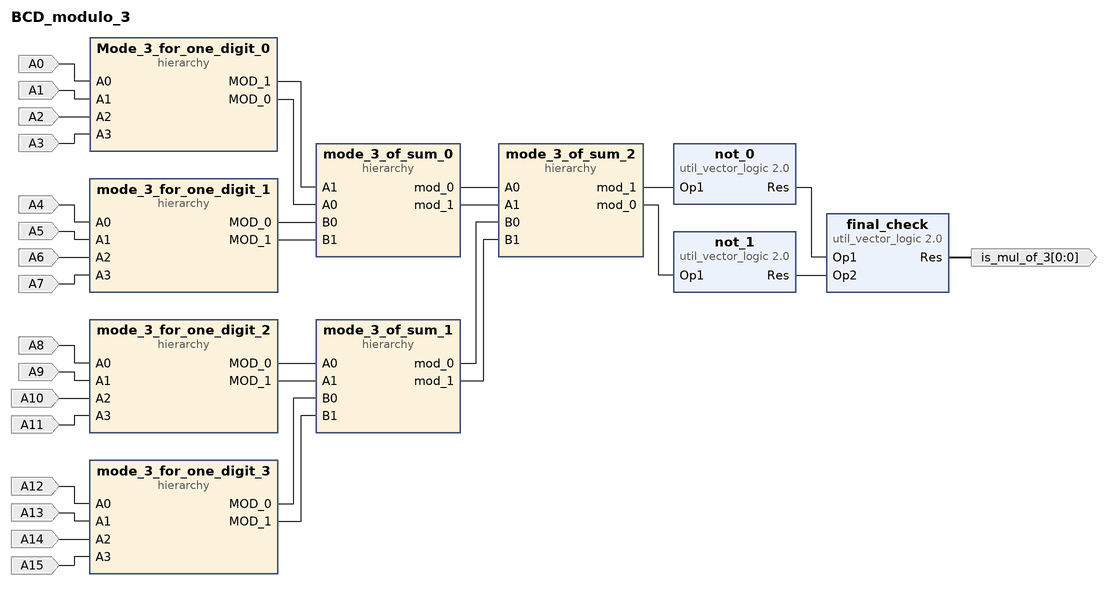
[diagram p0: block diagram of the top level]
# Vivado block design BCD_modulo_3, xc7a35tcpg236-1, Vivado 2019.1
create_bd_design BCD_modulo_3

create_bd_port -dir I A0
create_bd_port -dir I A1
create_bd_port -dir I A2
create_bd_port -dir I A3
create_bd_port -dir I A4
create_bd_port -dir I A5
create_bd_port -dir I A6
create_bd_port -dir I A7
create_bd_port -dir I A8
create_bd_port -dir I A9
create_bd_port -dir I A10
create_bd_port -dir I A11
create_bd_port -dir I A12
create_bd_port -dir I A13
create_bd_port -dir I A14
create_bd_port -dir I A15
create_bd_port -dir O -from 0 -to 0 is_mul_of_3

create_bd_cell -type hier Mode_3_for_one_digit_0
create_bd_cell -type hier mode_3_for_one_digit_1
create_bd_cell -type hier mode_3_of_sum_0
create_bd_cell -type hier mode_3_for_one_digit_2
create_bd_cell -type hier mode_3_for_one_digit_3
create_bd_cell -type hier mode_3_of_sum_1
create_bd_cell -type hier mode_3_of_sum_2
create_bd_cell -type ip -vlnv xilinx.com:ip:util_vector_logic:2.0 not_0
set_property -dict {CONFIG.C_OPERATION not CONFIG.C_SIZE 1} [get_bd_cells not_0]
create_bd_cell -type ip -vlnv xilinx.com:ip:util_vector_logic:2.0 not_1
set_property -dict {CONFIG.C_OPERATION not CONFIG.C_SIZE 1} [get_bd_cells not_1]
create_bd_cell -type ip -vlnv xilinx.com:ip:util_vector_logic:2.0 final_check
set_property -dict {CONFIG.C_OPERATION and CONFIG.C_SIZE 1} [get_bd_cells final_check]

# ---- hierarchy /Mode_3_for_one_digit_0 ----
current_bd_instance /Mode_3_for_one_digit_0
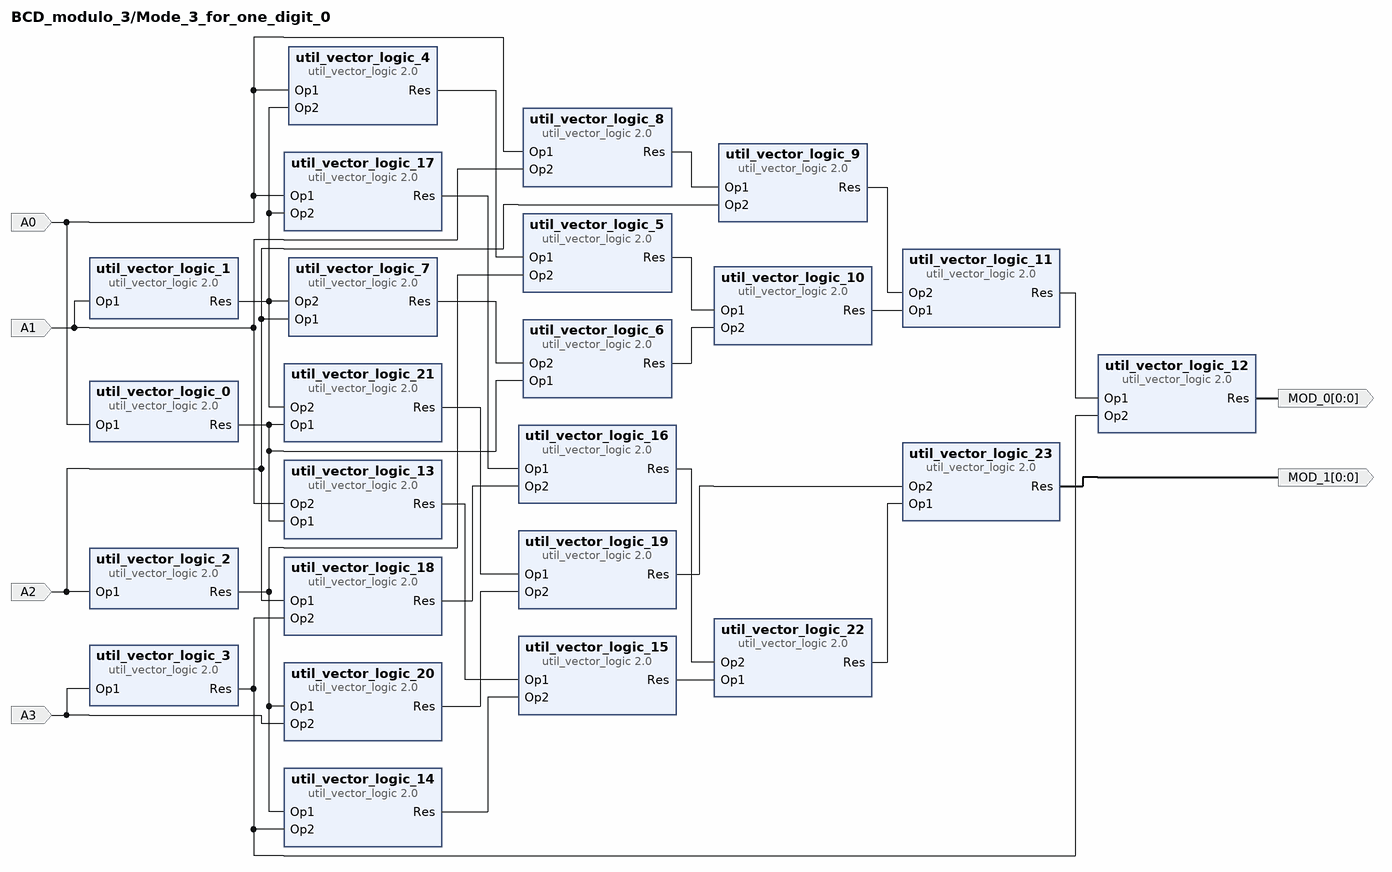
[diagram p1: block diagram inside /Mode_3_for_one_digit_0]
create_bd_pin -dir I A0
create_bd_pin -dir I A1
create_bd_pin -dir I A2
create_bd_pin -dir I A3
create_bd_pin -dir O -from 0 -to 0 MOD_0
create_bd_pin -dir O -from 0 -to 0 MOD_1

create_bd_cell -type ip -vlnv xilinx.com:ip:util_vector_logic:2.0 util_vector_logic_0
set_property -dict {CONFIG.C_OPERATION not CONFIG.C_SIZE 1} [get_bd_cells util_vector_logic_0]
create_bd_cell -type ip -vlnv xilinx.com:ip:util_vector_logic:2.0 util_vector_logic_1
set_property -dict {CONFIG.C_OPERATION not CONFIG.C_SIZE 1} [get_bd_cells util_vector_logic_1]
create_bd_cell -type ip -vlnv xilinx.com:ip:util_vector_logic:2.0 util_vector_logic_2
set_property -dict {CONFIG.C_OPERATION not CONFIG.C_SIZE 1} [get_bd_cells util_vector_logic_2]
create_bd_cell -type ip -vlnv xilinx.com:ip:util_vector_logic:2.0 util_vector_logic_3
set_property -dict {CONFIG.C_OPERATION not CONFIG.C_SIZE 1} [get_bd_cells util_vector_logic_3]
create_bd_cell -type ip -vlnv xilinx.com:ip:util_vector_logic:2.0 util_vector_logic_4
set_property -dict {CONFIG.C_SIZE 1} [get_bd_cells util_vector_logic_4]
create_bd_cell -type ip -vlnv xilinx.com:ip:util_vector_logic:2.0 util_vector_logic_5
set_property -dict {CONFIG.C_SIZE 1} [get_bd_cells util_vector_logic_5]
create_bd_cell -type ip -vlnv xilinx.com:ip:util_vector_logic:2.0 util_vector_logic_6
set_property -dict {CONFIG.C_SIZE 1} [get_bd_cells util_vector_logic_6]
create_bd_cell -type ip -vlnv xilinx.com:ip:util_vector_logic:2.0 util_vector_logic_7
set_property -dict {CONFIG.C_SIZE 1} [get_bd_cells util_vector_logic_7]
create_bd_cell -type ip -vlnv xilinx.com:ip:util_vector_logic:2.0 util_vector_logic_8
set_property -dict {CONFIG.C_SIZE 1} [get_bd_cells util_vector_logic_8]
create_bd_cell -type ip -vlnv xilinx.com:ip:util_vector_logic:2.0 util_vector_logic_9
set_property -dict {CONFIG.C_SIZE 1} [get_bd_cells util_vector_logic_9]
create_bd_cell -type ip -vlnv xilinx.com:ip:util_vector_logic:2.0 util_vector_logic_10
set_property -dict {CONFIG.C_OPERATION or CONFIG.C_SIZE 1} [get_bd_cells util_vector_logic_10]
create_bd_cell -type ip -vlnv xilinx.com:ip:util_vector_logic:2.0 util_vector_logic_11
set_property -dict {CONFIG.C_OPERATION or CONFIG.C_SIZE 1} [get_bd_cells util_vector_logic_11]
create_bd_cell -type ip -vlnv xilinx.com:ip:util_vector_logic:2.0 util_vector_logic_12
set_property -dict {CONFIG.C_SIZE 1} [get_bd_cells util_vector_logic_12]
create_bd_cell -type ip -vlnv xilinx.com:ip:util_vector_logic:2.0 util_vector_logic_13
set_property -dict {CONFIG.C_SIZE 1} [get_bd_cells util_vector_logic_13]
create_bd_cell -type ip -vlnv xilinx.com:ip:util_vector_logic:2.0 util_vector_logic_14
set_property -dict {CONFIG.C_SIZE 1} [get_bd_cells util_vector_logic_14]
create_bd_cell -type ip -vlnv xilinx.com:ip:util_vector_logic:2.0 util_vector_logic_15
set_property -dict {CONFIG.C_SIZE 1} [get_bd_cells util_vector_logic_15]
create_bd_cell -type ip -vlnv xilinx.com:ip:util_vector_logic:2.0 util_vector_logic_16
set_property -dict {CONFIG.C_SIZE 1} [get_bd_cells util_vector_logic_16]
create_bd_cell -type ip -vlnv xilinx.com:ip:util_vector_logic:2.0 util_vector_logic_17
set_property -dict {CONFIG.C_SIZE 1} [get_bd_cells util_vector_logic_17]
create_bd_cell -type ip -vlnv xilinx.com:ip:util_vector_logic:2.0 util_vector_logic_18
set_property -dict {CONFIG.C_SIZE 1} [get_bd_cells util_vector_logic_18]
create_bd_cell -type ip -vlnv xilinx.com:ip:util_vector_logic:2.0 util_vector_logic_19
set_property -dict {CONFIG.C_SIZE 1} [get_bd_cells util_vector_logic_19]
create_bd_cell -type ip -vlnv xilinx.com:ip:util_vector_logic:2.0 util_vector_logic_20
set_property -dict {CONFIG.C_SIZE 1} [get_bd_cells util_vector_logic_20]
create_bd_cell -type ip -vlnv xilinx.com:ip:util_vector_logic:2.0 util_vector_logic_21
set_property -dict {CONFIG.C_SIZE 1} [get_bd_cells util_vector_logic_21]
create_bd_cell -type ip -vlnv xilinx.com:ip:util_vector_logic:2.0 util_vector_logic_22
set_property -dict {CONFIG.C_OPERATION or CONFIG.C_SIZE 1} [get_bd_cells util_vector_logic_22]
create_bd_cell -type ip -vlnv xilinx.com:ip:util_vector_logic:2.0 util_vector_logic_23
set_property -dict {CONFIG.C_OPERATION or CONFIG.C_SIZE 1} [get_bd_cells util_vector_logic_23]

# ---- hierarchy /mode_3_for_one_digit_1 ----
current_bd_instance /mode_3_for_one_digit_1
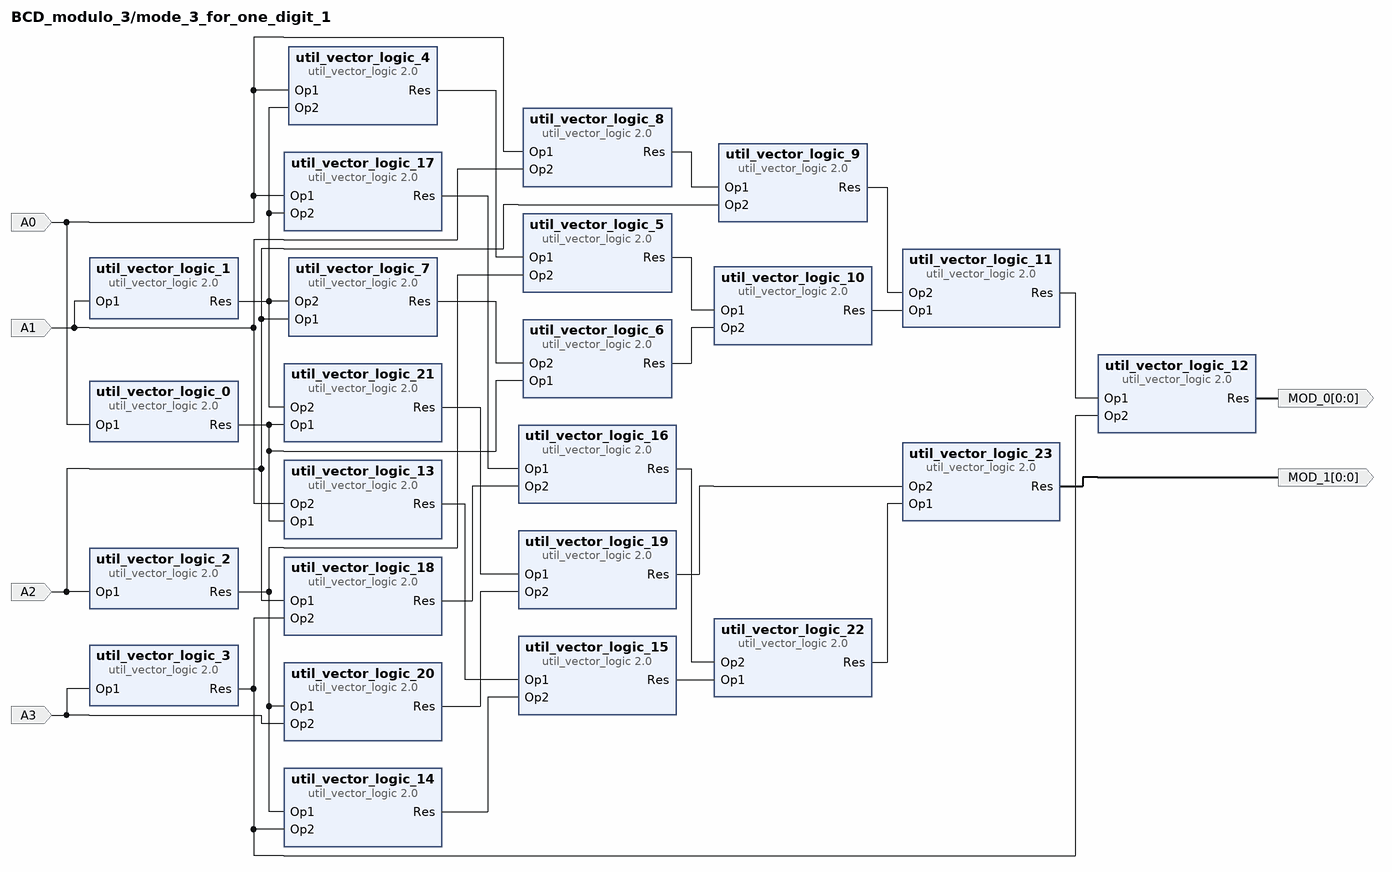
[diagram p2: block diagram inside /mode_3_for_one_digit_1]
create_bd_pin -dir I A0
create_bd_pin -dir I A1
create_bd_pin -dir I A2
create_bd_pin -dir I A3
create_bd_pin -dir O -from 0 -to 0 MOD_0
create_bd_pin -dir O -from 0 -to 0 MOD_1

create_bd_cell -type ip -vlnv xilinx.com:ip:util_vector_logic:2.0 util_vector_logic_0
set_property -dict {CONFIG.C_OPERATION not CONFIG.C_SIZE 1} [get_bd_cells util_vector_logic_0]
create_bd_cell -type ip -vlnv xilinx.com:ip:util_vector_logic:2.0 util_vector_logic_1
set_property -dict {CONFIG.C_OPERATION not CONFIG.C_SIZE 1} [get_bd_cells util_vector_logic_1]
create_bd_cell -type ip -vlnv xilinx.com:ip:util_vector_logic:2.0 util_vector_logic_2
set_property -dict {CONFIG.C_OPERATION not CONFIG.C_SIZE 1} [get_bd_cells util_vector_logic_2]
create_bd_cell -type ip -vlnv xilinx.com:ip:util_vector_logic:2.0 util_vector_logic_3
set_property -dict {CONFIG.C_OPERATION not CONFIG.C_SIZE 1} [get_bd_cells util_vector_logic_3]
create_bd_cell -type ip -vlnv xilinx.com:ip:util_vector_logic:2.0 util_vector_logic_4
set_property -dict {CONFIG.C_SIZE 1} [get_bd_cells util_vector_logic_4]
create_bd_cell -type ip -vlnv xilinx.com:ip:util_vector_logic:2.0 util_vector_logic_5
set_property -dict {CONFIG.C_SIZE 1} [get_bd_cells util_vector_logic_5]
create_bd_cell -type ip -vlnv xilinx.com:ip:util_vector_logic:2.0 util_vector_logic_6
set_property -dict {CONFIG.C_SIZE 1} [get_bd_cells util_vector_logic_6]
create_bd_cell -type ip -vlnv xilinx.com:ip:util_vector_logic:2.0 util_vector_logic_7
set_property -dict {CONFIG.C_SIZE 1} [get_bd_cells util_vector_logic_7]
create_bd_cell -type ip -vlnv xilinx.com:ip:util_vector_logic:2.0 util_vector_logic_8
set_property -dict {CONFIG.C_SIZE 1} [get_bd_cells util_vector_logic_8]
create_bd_cell -type ip -vlnv xilinx.com:ip:util_vector_logic:2.0 util_vector_logic_9
set_property -dict {CONFIG.C_SIZE 1} [get_bd_cells util_vector_logic_9]
create_bd_cell -type ip -vlnv xilinx.com:ip:util_vector_logic:2.0 util_vector_logic_10
set_property -dict {CONFIG.C_OPERATION or CONFIG.C_SIZE 1} [get_bd_cells util_vector_logic_10]
create_bd_cell -type ip -vlnv xilinx.com:ip:util_vector_logic:2.0 util_vector_logic_11
set_property -dict {CONFIG.C_OPERATION or CONFIG.C_SIZE 1} [get_bd_cells util_vector_logic_11]
create_bd_cell -type ip -vlnv xilinx.com:ip:util_vector_logic:2.0 util_vector_logic_12
set_property -dict {CONFIG.C_SIZE 1} [get_bd_cells util_vector_logic_12]
create_bd_cell -type ip -vlnv xilinx.com:ip:util_vector_logic:2.0 util_vector_logic_13
set_property -dict {CONFIG.C_SIZE 1} [get_bd_cells util_vector_logic_13]
create_bd_cell -type ip -vlnv xilinx.com:ip:util_vector_logic:2.0 util_vector_logic_14
set_property -dict {CONFIG.C_SIZE 1} [get_bd_cells util_vector_logic_14]
create_bd_cell -type ip -vlnv xilinx.com:ip:util_vector_logic:2.0 util_vector_logic_15
set_property -dict {CONFIG.C_SIZE 1} [get_bd_cells util_vector_logic_15]
create_bd_cell -type ip -vlnv xilinx.com:ip:util_vector_logic:2.0 util_vector_logic_16
set_property -dict {CONFIG.C_SIZE 1} [get_bd_cells util_vector_logic_16]
create_bd_cell -type ip -vlnv xilinx.com:ip:util_vector_logic:2.0 util_vector_logic_17
set_property -dict {CONFIG.C_SIZE 1} [get_bd_cells util_vector_logic_17]
create_bd_cell -type ip -vlnv xilinx.com:ip:util_vector_logic:2.0 util_vector_logic_18
set_property -dict {CONFIG.C_SIZE 1} [get_bd_cells util_vector_logic_18]
create_bd_cell -type ip -vlnv xilinx.com:ip:util_vector_logic:2.0 util_vector_logic_19
set_property -dict {CONFIG.C_SIZE 1} [get_bd_cells util_vector_logic_19]
create_bd_cell -type ip -vlnv xilinx.com:ip:util_vector_logic:2.0 util_vector_logic_20
set_property -dict {CONFIG.C_SIZE 1} [get_bd_cells util_vector_logic_20]
create_bd_cell -type ip -vlnv xilinx.com:ip:util_vector_logic:2.0 util_vector_logic_21
set_property -dict {CONFIG.C_SIZE 1} [get_bd_cells util_vector_logic_21]
create_bd_cell -type ip -vlnv xilinx.com:ip:util_vector_logic:2.0 util_vector_logic_22
set_property -dict {CONFIG.C_OPERATION or CONFIG.C_SIZE 1} [get_bd_cells util_vector_logic_22]
create_bd_cell -type ip -vlnv xilinx.com:ip:util_vector_logic:2.0 util_vector_logic_23
set_property -dict {CONFIG.C_OPERATION or CONFIG.C_SIZE 1} [get_bd_cells util_vector_logic_23]

# ---- hierarchy /mode_3_of_sum_0 ----
current_bd_instance /mode_3_of_sum_0
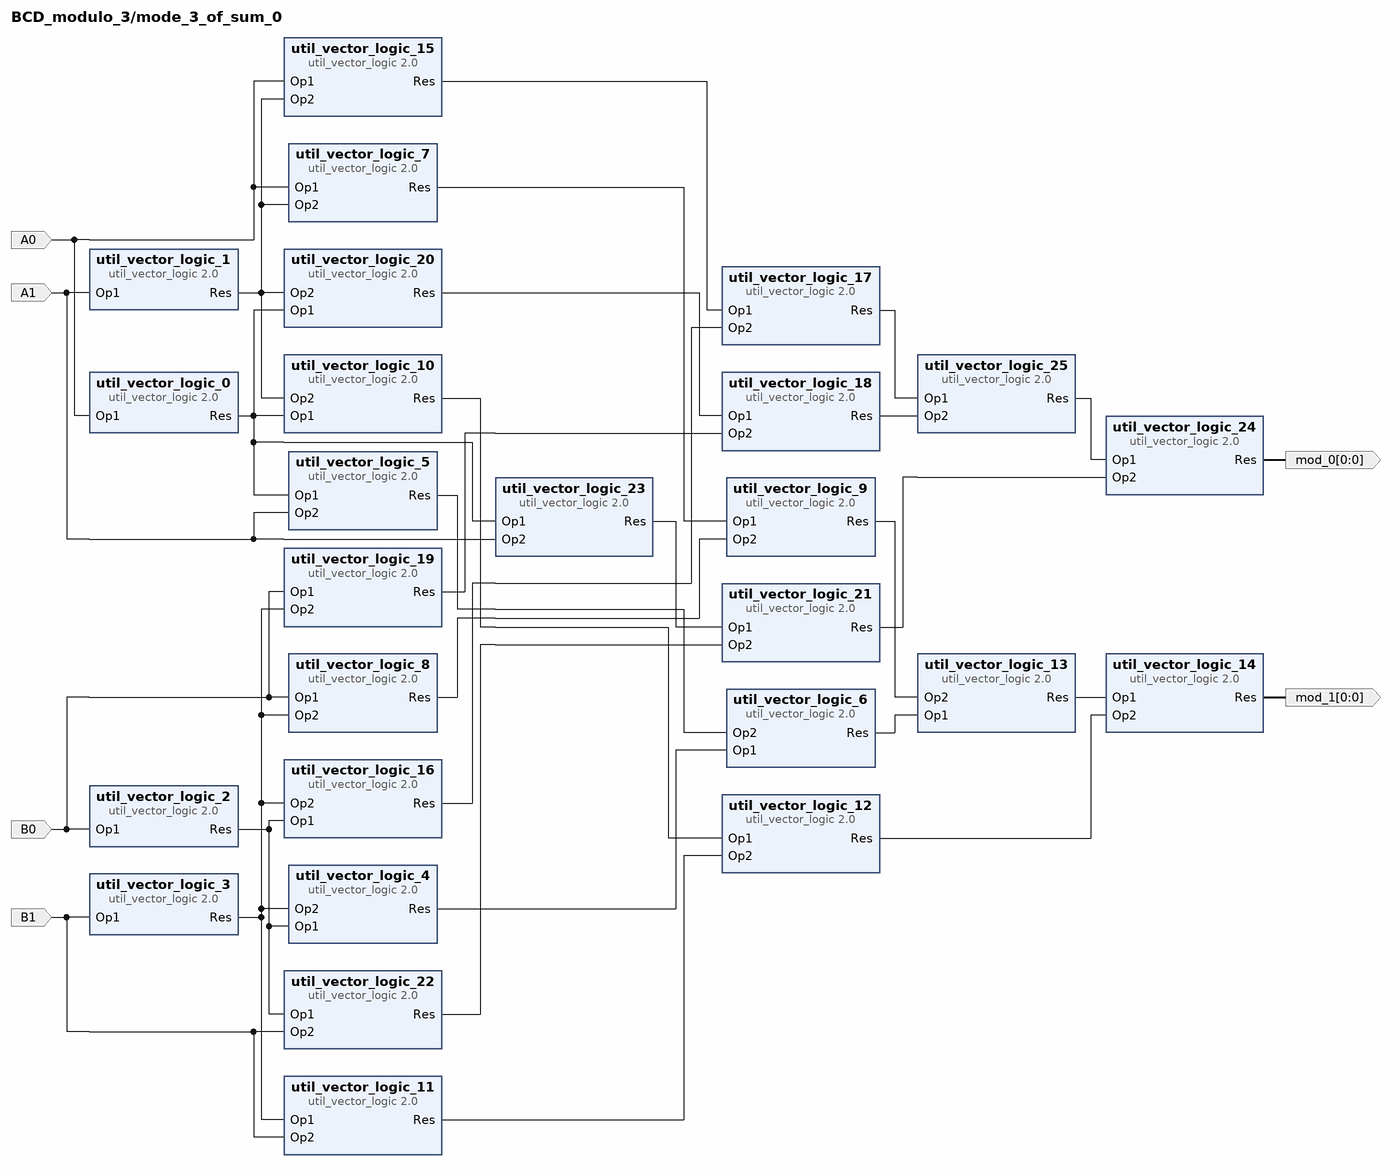
[diagram p3: block diagram inside /mode_3_of_sum_0]
create_bd_pin -dir I A0
create_bd_pin -dir I A1
create_bd_pin -dir I B0
create_bd_pin -dir I B1
create_bd_pin -dir O -from 0 -to 0 mod_1
create_bd_pin -dir O -from 0 -to 0 mod_0

create_bd_cell -type ip -vlnv xilinx.com:ip:util_vector_logic:2.0 util_vector_logic_0
set_property -dict {CONFIG.C_OPERATION not CONFIG.C_SIZE 1} [get_bd_cells util_vector_logic_0]
create_bd_cell -type ip -vlnv xilinx.com:ip:util_vector_logic:2.0 util_vector_logic_1
set_property -dict {CONFIG.C_OPERATION not CONFIG.C_SIZE 1} [get_bd_cells util_vector_logic_1]
create_bd_cell -type ip -vlnv xilinx.com:ip:util_vector_logic:2.0 util_vector_logic_2
set_property -dict {CONFIG.C_OPERATION not CONFIG.C_SIZE 1} [get_bd_cells util_vector_logic_2]
create_bd_cell -type ip -vlnv xilinx.com:ip:util_vector_logic:2.0 util_vector_logic_3
set_property -dict {CONFIG.C_OPERATION not CONFIG.C_SIZE 1} [get_bd_cells util_vector_logic_3]
create_bd_cell -type ip -vlnv xilinx.com:ip:util_vector_logic:2.0 util_vector_logic_4
set_property -dict {CONFIG.C_SIZE 1} [get_bd_cells util_vector_logic_4]
create_bd_cell -type ip -vlnv xilinx.com:ip:util_vector_logic:2.0 util_vector_logic_5
set_property -dict {CONFIG.C_SIZE 1} [get_bd_cells util_vector_logic_5]
create_bd_cell -type ip -vlnv xilinx.com:ip:util_vector_logic:2.0 util_vector_logic_6
set_property -dict {CONFIG.C_SIZE 1} [get_bd_cells util_vector_logic_6]
create_bd_cell -type ip -vlnv xilinx.com:ip:util_vector_logic:2.0 util_vector_logic_7
set_property -dict {CONFIG.C_SIZE 1} [get_bd_cells util_vector_logic_7]
create_bd_cell -type ip -vlnv xilinx.com:ip:util_vector_logic:2.0 util_vector_logic_8
set_property -dict {CONFIG.C_SIZE 1} [get_bd_cells util_vector_logic_8]
create_bd_cell -type ip -vlnv xilinx.com:ip:util_vector_logic:2.0 util_vector_logic_9
set_property -dict {CONFIG.C_SIZE 1} [get_bd_cells util_vector_logic_9]
create_bd_cell -type ip -vlnv xilinx.com:ip:util_vector_logic:2.0 util_vector_logic_10
set_property -dict {CONFIG.C_SIZE 1} [get_bd_cells util_vector_logic_10]
create_bd_cell -type ip -vlnv xilinx.com:ip:util_vector_logic:2.0 util_vector_logic_11
set_property -dict {CONFIG.C_SIZE 1} [get_bd_cells util_vector_logic_11]
create_bd_cell -type ip -vlnv xilinx.com:ip:util_vector_logic:2.0 util_vector_logic_12
set_property -dict {CONFIG.C_SIZE 1} [get_bd_cells util_vector_logic_12]
create_bd_cell -type ip -vlnv xilinx.com:ip:util_vector_logic:2.0 util_vector_logic_13
set_property -dict {CONFIG.C_OPERATION or CONFIG.C_SIZE 1} [get_bd_cells util_vector_logic_13]
create_bd_cell -type ip -vlnv xilinx.com:ip:util_vector_logic:2.0 util_vector_logic_14
set_property -dict {CONFIG.C_OPERATION or CONFIG.C_SIZE 1} [get_bd_cells util_vector_logic_14]
create_bd_cell -type ip -vlnv xilinx.com:ip:util_vector_logic:2.0 util_vector_logic_15
set_property -dict {CONFIG.C_SIZE 1} [get_bd_cells util_vector_logic_15]
create_bd_cell -type ip -vlnv xilinx.com:ip:util_vector_logic:2.0 util_vector_logic_16
set_property -dict {CONFIG.C_SIZE 1} [get_bd_cells util_vector_logic_16]
create_bd_cell -type ip -vlnv xilinx.com:ip:util_vector_logic:2.0 util_vector_logic_17
set_property -dict {CONFIG.C_SIZE 1} [get_bd_cells util_vector_logic_17]
create_bd_cell -type ip -vlnv xilinx.com:ip:util_vector_logic:2.0 util_vector_logic_18
set_property -dict {CONFIG.C_SIZE 1} [get_bd_cells util_vector_logic_18]
create_bd_cell -type ip -vlnv xilinx.com:ip:util_vector_logic:2.0 util_vector_logic_19
set_property -dict {CONFIG.C_SIZE 1} [get_bd_cells util_vector_logic_19]
create_bd_cell -type ip -vlnv xilinx.com:ip:util_vector_logic:2.0 util_vector_logic_20
set_property -dict {CONFIG.C_SIZE 1} [get_bd_cells util_vector_logic_20]
create_bd_cell -type ip -vlnv xilinx.com:ip:util_vector_logic:2.0 util_vector_logic_21
set_property -dict {CONFIG.C_SIZE 1} [get_bd_cells util_vector_logic_21]
create_bd_cell -type ip -vlnv xilinx.com:ip:util_vector_logic:2.0 util_vector_logic_22
set_property -dict {CONFIG.C_SIZE 1} [get_bd_cells util_vector_logic_22]
create_bd_cell -type ip -vlnv xilinx.com:ip:util_vector_logic:2.0 util_vector_logic_23
set_property -dict {CONFIG.C_SIZE 1} [get_bd_cells util_vector_logic_23]
create_bd_cell -type ip -vlnv xilinx.com:ip:util_vector_logic:2.0 util_vector_logic_24
set_property -dict {CONFIG.C_OPERATION or CONFIG.C_SIZE 1} [get_bd_cells util_vector_logic_24]
create_bd_cell -type ip -vlnv xilinx.com:ip:util_vector_logic:2.0 util_vector_logic_25
set_property -dict {CONFIG.C_OPERATION or CONFIG.C_SIZE 1} [get_bd_cells util_vector_logic_25]

# ---- hierarchy /mode_3_for_one_digit_2 ----
current_bd_instance /mode_3_for_one_digit_2
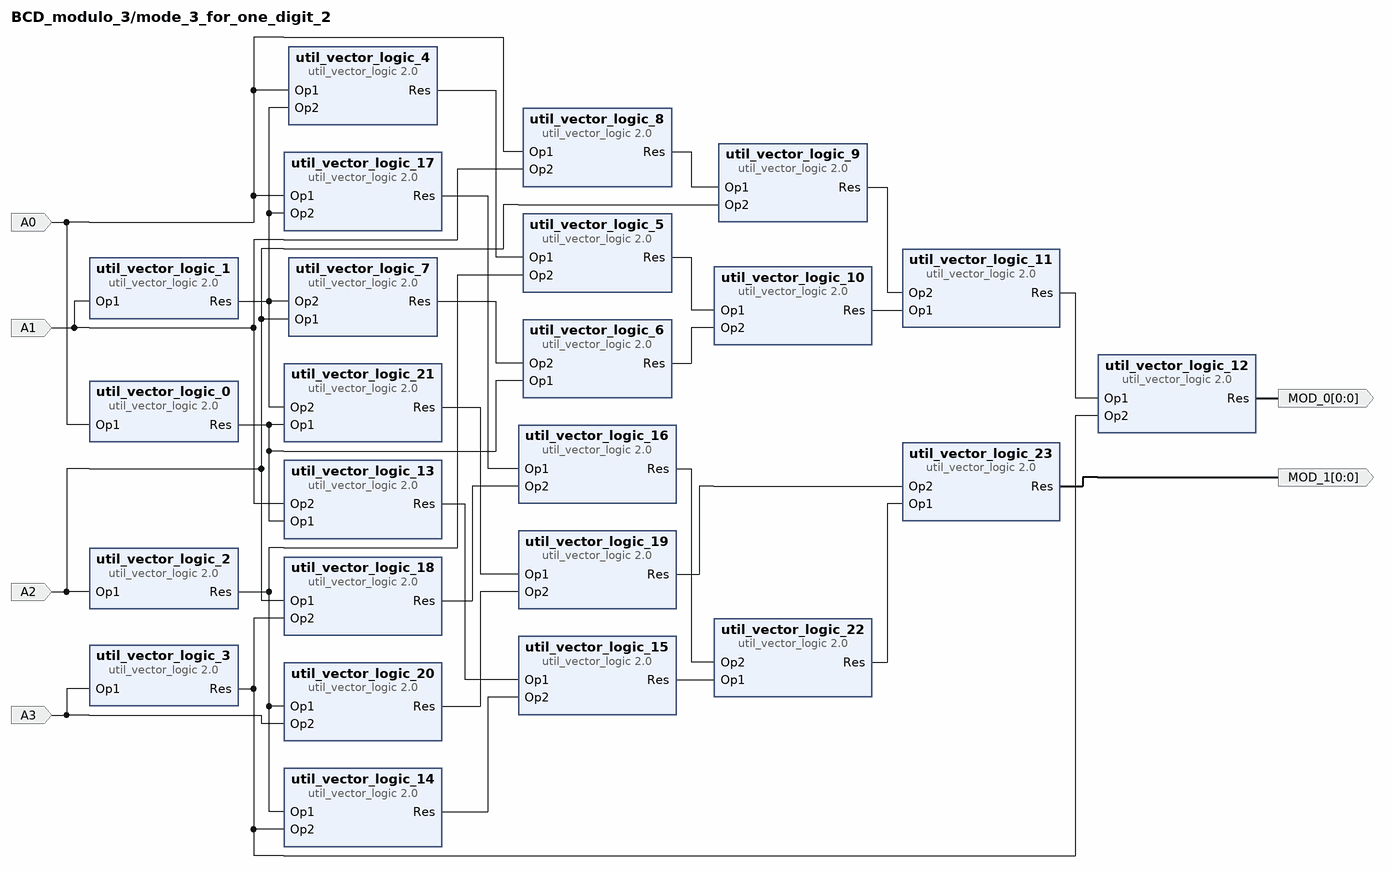
[diagram p4: block diagram inside /mode_3_for_one_digit_2]
create_bd_pin -dir I A0
create_bd_pin -dir I A1
create_bd_pin -dir I A2
create_bd_pin -dir I A3
create_bd_pin -dir O -from 0 -to 0 MOD_0
create_bd_pin -dir O -from 0 -to 0 MOD_1

create_bd_cell -type ip -vlnv xilinx.com:ip:util_vector_logic:2.0 util_vector_logic_0
set_property -dict {CONFIG.C_OPERATION not CONFIG.C_SIZE 1} [get_bd_cells util_vector_logic_0]
create_bd_cell -type ip -vlnv xilinx.com:ip:util_vector_logic:2.0 util_vector_logic_1
set_property -dict {CONFIG.C_OPERATION not CONFIG.C_SIZE 1} [get_bd_cells util_vector_logic_1]
create_bd_cell -type ip -vlnv xilinx.com:ip:util_vector_logic:2.0 util_vector_logic_2
set_property -dict {CONFIG.C_OPERATION not CONFIG.C_SIZE 1} [get_bd_cells util_vector_logic_2]
create_bd_cell -type ip -vlnv xilinx.com:ip:util_vector_logic:2.0 util_vector_logic_3
set_property -dict {CONFIG.C_OPERATION not CONFIG.C_SIZE 1} [get_bd_cells util_vector_logic_3]
create_bd_cell -type ip -vlnv xilinx.com:ip:util_vector_logic:2.0 util_vector_logic_4
set_property -dict {CONFIG.C_SIZE 1} [get_bd_cells util_vector_logic_4]
create_bd_cell -type ip -vlnv xilinx.com:ip:util_vector_logic:2.0 util_vector_logic_5
set_property -dict {CONFIG.C_SIZE 1} [get_bd_cells util_vector_logic_5]
create_bd_cell -type ip -vlnv xilinx.com:ip:util_vector_logic:2.0 util_vector_logic_6
set_property -dict {CONFIG.C_SIZE 1} [get_bd_cells util_vector_logic_6]
create_bd_cell -type ip -vlnv xilinx.com:ip:util_vector_logic:2.0 util_vector_logic_7
set_property -dict {CONFIG.C_SIZE 1} [get_bd_cells util_vector_logic_7]
create_bd_cell -type ip -vlnv xilinx.com:ip:util_vector_logic:2.0 util_vector_logic_8
set_property -dict {CONFIG.C_SIZE 1} [get_bd_cells util_vector_logic_8]
create_bd_cell -type ip -vlnv xilinx.com:ip:util_vector_logic:2.0 util_vector_logic_9
set_property -dict {CONFIG.C_SIZE 1} [get_bd_cells util_vector_logic_9]
create_bd_cell -type ip -vlnv xilinx.com:ip:util_vector_logic:2.0 util_vector_logic_10
set_property -dict {CONFIG.C_OPERATION or CONFIG.C_SIZE 1} [get_bd_cells util_vector_logic_10]
create_bd_cell -type ip -vlnv xilinx.com:ip:util_vector_logic:2.0 util_vector_logic_11
set_property -dict {CONFIG.C_OPERATION or CONFIG.C_SIZE 1} [get_bd_cells util_vector_logic_11]
create_bd_cell -type ip -vlnv xilinx.com:ip:util_vector_logic:2.0 util_vector_logic_12
set_property -dict {CONFIG.C_SIZE 1} [get_bd_cells util_vector_logic_12]
create_bd_cell -type ip -vlnv xilinx.com:ip:util_vector_logic:2.0 util_vector_logic_13
set_property -dict {CONFIG.C_SIZE 1} [get_bd_cells util_vector_logic_13]
create_bd_cell -type ip -vlnv xilinx.com:ip:util_vector_logic:2.0 util_vector_logic_14
set_property -dict {CONFIG.C_SIZE 1} [get_bd_cells util_vector_logic_14]
create_bd_cell -type ip -vlnv xilinx.com:ip:util_vector_logic:2.0 util_vector_logic_15
set_property -dict {CONFIG.C_SIZE 1} [get_bd_cells util_vector_logic_15]
create_bd_cell -type ip -vlnv xilinx.com:ip:util_vector_logic:2.0 util_vector_logic_16
set_property -dict {CONFIG.C_SIZE 1} [get_bd_cells util_vector_logic_16]
create_bd_cell -type ip -vlnv xilinx.com:ip:util_vector_logic:2.0 util_vector_logic_17
set_property -dict {CONFIG.C_SIZE 1} [get_bd_cells util_vector_logic_17]
create_bd_cell -type ip -vlnv xilinx.com:ip:util_vector_logic:2.0 util_vector_logic_18
set_property -dict {CONFIG.C_SIZE 1} [get_bd_cells util_vector_logic_18]
create_bd_cell -type ip -vlnv xilinx.com:ip:util_vector_logic:2.0 util_vector_logic_19
set_property -dict {CONFIG.C_SIZE 1} [get_bd_cells util_vector_logic_19]
create_bd_cell -type ip -vlnv xilinx.com:ip:util_vector_logic:2.0 util_vector_logic_20
set_property -dict {CONFIG.C_SIZE 1} [get_bd_cells util_vector_logic_20]
create_bd_cell -type ip -vlnv xilinx.com:ip:util_vector_logic:2.0 util_vector_logic_21
set_property -dict {CONFIG.C_SIZE 1} [get_bd_cells util_vector_logic_21]
create_bd_cell -type ip -vlnv xilinx.com:ip:util_vector_logic:2.0 util_vector_logic_22
set_property -dict {CONFIG.C_OPERATION or CONFIG.C_SIZE 1} [get_bd_cells util_vector_logic_22]
create_bd_cell -type ip -vlnv xilinx.com:ip:util_vector_logic:2.0 util_vector_logic_23
set_property -dict {CONFIG.C_OPERATION or CONFIG.C_SIZE 1} [get_bd_cells util_vector_logic_23]

# ---- hierarchy /mode_3_for_one_digit_3 ----
current_bd_instance /mode_3_for_one_digit_3
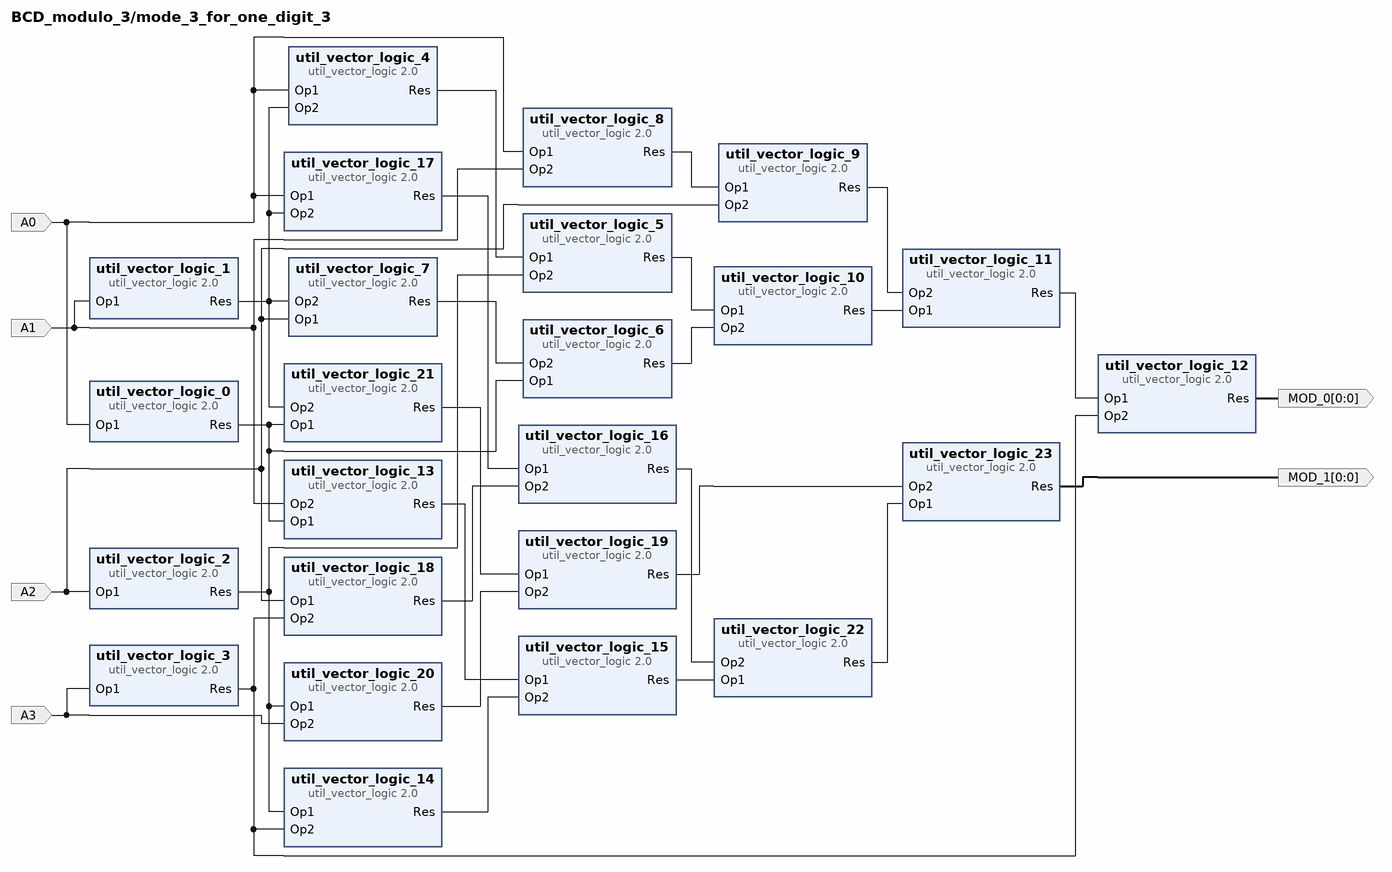
[diagram p5: block diagram inside /mode_3_for_one_digit_3]
create_bd_pin -dir I A0
create_bd_pin -dir I A1
create_bd_pin -dir I A2
create_bd_pin -dir I A3
create_bd_pin -dir O -from 0 -to 0 MOD_0
create_bd_pin -dir O -from 0 -to 0 MOD_1

create_bd_cell -type ip -vlnv xilinx.com:ip:util_vector_logic:2.0 util_vector_logic_0
set_property -dict {CONFIG.C_OPERATION not CONFIG.C_SIZE 1} [get_bd_cells util_vector_logic_0]
create_bd_cell -type ip -vlnv xilinx.com:ip:util_vector_logic:2.0 util_vector_logic_1
set_property -dict {CONFIG.C_OPERATION not CONFIG.C_SIZE 1} [get_bd_cells util_vector_logic_1]
create_bd_cell -type ip -vlnv xilinx.com:ip:util_vector_logic:2.0 util_vector_logic_2
set_property -dict {CONFIG.C_OPERATION not CONFIG.C_SIZE 1} [get_bd_cells util_vector_logic_2]
create_bd_cell -type ip -vlnv xilinx.com:ip:util_vector_logic:2.0 util_vector_logic_3
set_property -dict {CONFIG.C_OPERATION not CONFIG.C_SIZE 1} [get_bd_cells util_vector_logic_3]
create_bd_cell -type ip -vlnv xilinx.com:ip:util_vector_logic:2.0 util_vector_logic_4
set_property -dict {CONFIG.C_SIZE 1} [get_bd_cells util_vector_logic_4]
create_bd_cell -type ip -vlnv xilinx.com:ip:util_vector_logic:2.0 util_vector_logic_5
set_property -dict {CONFIG.C_SIZE 1} [get_bd_cells util_vector_logic_5]
create_bd_cell -type ip -vlnv xilinx.com:ip:util_vector_logic:2.0 util_vector_logic_6
set_property -dict {CONFIG.C_SIZE 1} [get_bd_cells util_vector_logic_6]
create_bd_cell -type ip -vlnv xilinx.com:ip:util_vector_logic:2.0 util_vector_logic_7
set_property -dict {CONFIG.C_SIZE 1} [get_bd_cells util_vector_logic_7]
create_bd_cell -type ip -vlnv xilinx.com:ip:util_vector_logic:2.0 util_vector_logic_8
set_property -dict {CONFIG.C_SIZE 1} [get_bd_cells util_vector_logic_8]
create_bd_cell -type ip -vlnv xilinx.com:ip:util_vector_logic:2.0 util_vector_logic_9
set_property -dict {CONFIG.C_SIZE 1} [get_bd_cells util_vector_logic_9]
create_bd_cell -type ip -vlnv xilinx.com:ip:util_vector_logic:2.0 util_vector_logic_10
set_property -dict {CONFIG.C_OPERATION or CONFIG.C_SIZE 1} [get_bd_cells util_vector_logic_10]
create_bd_cell -type ip -vlnv xilinx.com:ip:util_vector_logic:2.0 util_vector_logic_11
set_property -dict {CONFIG.C_OPERATION or CONFIG.C_SIZE 1} [get_bd_cells util_vector_logic_11]
create_bd_cell -type ip -vlnv xilinx.com:ip:util_vector_logic:2.0 util_vector_logic_12
set_property -dict {CONFIG.C_SIZE 1} [get_bd_cells util_vector_logic_12]
create_bd_cell -type ip -vlnv xilinx.com:ip:util_vector_logic:2.0 util_vector_logic_13
set_property -dict {CONFIG.C_SIZE 1} [get_bd_cells util_vector_logic_13]
create_bd_cell -type ip -vlnv xilinx.com:ip:util_vector_logic:2.0 util_vector_logic_14
set_property -dict {CONFIG.C_SIZE 1} [get_bd_cells util_vector_logic_14]
create_bd_cell -type ip -vlnv xilinx.com:ip:util_vector_logic:2.0 util_vector_logic_15
set_property -dict {CONFIG.C_SIZE 1} [get_bd_cells util_vector_logic_15]
create_bd_cell -type ip -vlnv xilinx.com:ip:util_vector_logic:2.0 util_vector_logic_16
set_property -dict {CONFIG.C_SIZE 1} [get_bd_cells util_vector_logic_16]
create_bd_cell -type ip -vlnv xilinx.com:ip:util_vector_logic:2.0 util_vector_logic_17
set_property -dict {CONFIG.C_SIZE 1} [get_bd_cells util_vector_logic_17]
create_bd_cell -type ip -vlnv xilinx.com:ip:util_vector_logic:2.0 util_vector_logic_18
set_property -dict {CONFIG.C_SIZE 1} [get_bd_cells util_vector_logic_18]
create_bd_cell -type ip -vlnv xilinx.com:ip:util_vector_logic:2.0 util_vector_logic_19
set_property -dict {CONFIG.C_SIZE 1} [get_bd_cells util_vector_logic_19]
create_bd_cell -type ip -vlnv xilinx.com:ip:util_vector_logic:2.0 util_vector_logic_20
set_property -dict {CONFIG.C_SIZE 1} [get_bd_cells util_vector_logic_20]
create_bd_cell -type ip -vlnv xilinx.com:ip:util_vector_logic:2.0 util_vector_logic_21
set_property -dict {CONFIG.C_SIZE 1} [get_bd_cells util_vector_logic_21]
create_bd_cell -type ip -vlnv xilinx.com:ip:util_vector_logic:2.0 util_vector_logic_22
set_property -dict {CONFIG.C_OPERATION or CONFIG.C_SIZE 1} [get_bd_cells util_vector_logic_22]
create_bd_cell -type ip -vlnv xilinx.com:ip:util_vector_logic:2.0 util_vector_logic_23
set_property -dict {CONFIG.C_OPERATION or CONFIG.C_SIZE 1} [get_bd_cells util_vector_logic_23]

# ---- hierarchy /mode_3_of_sum_1 ----
current_bd_instance /mode_3_of_sum_1
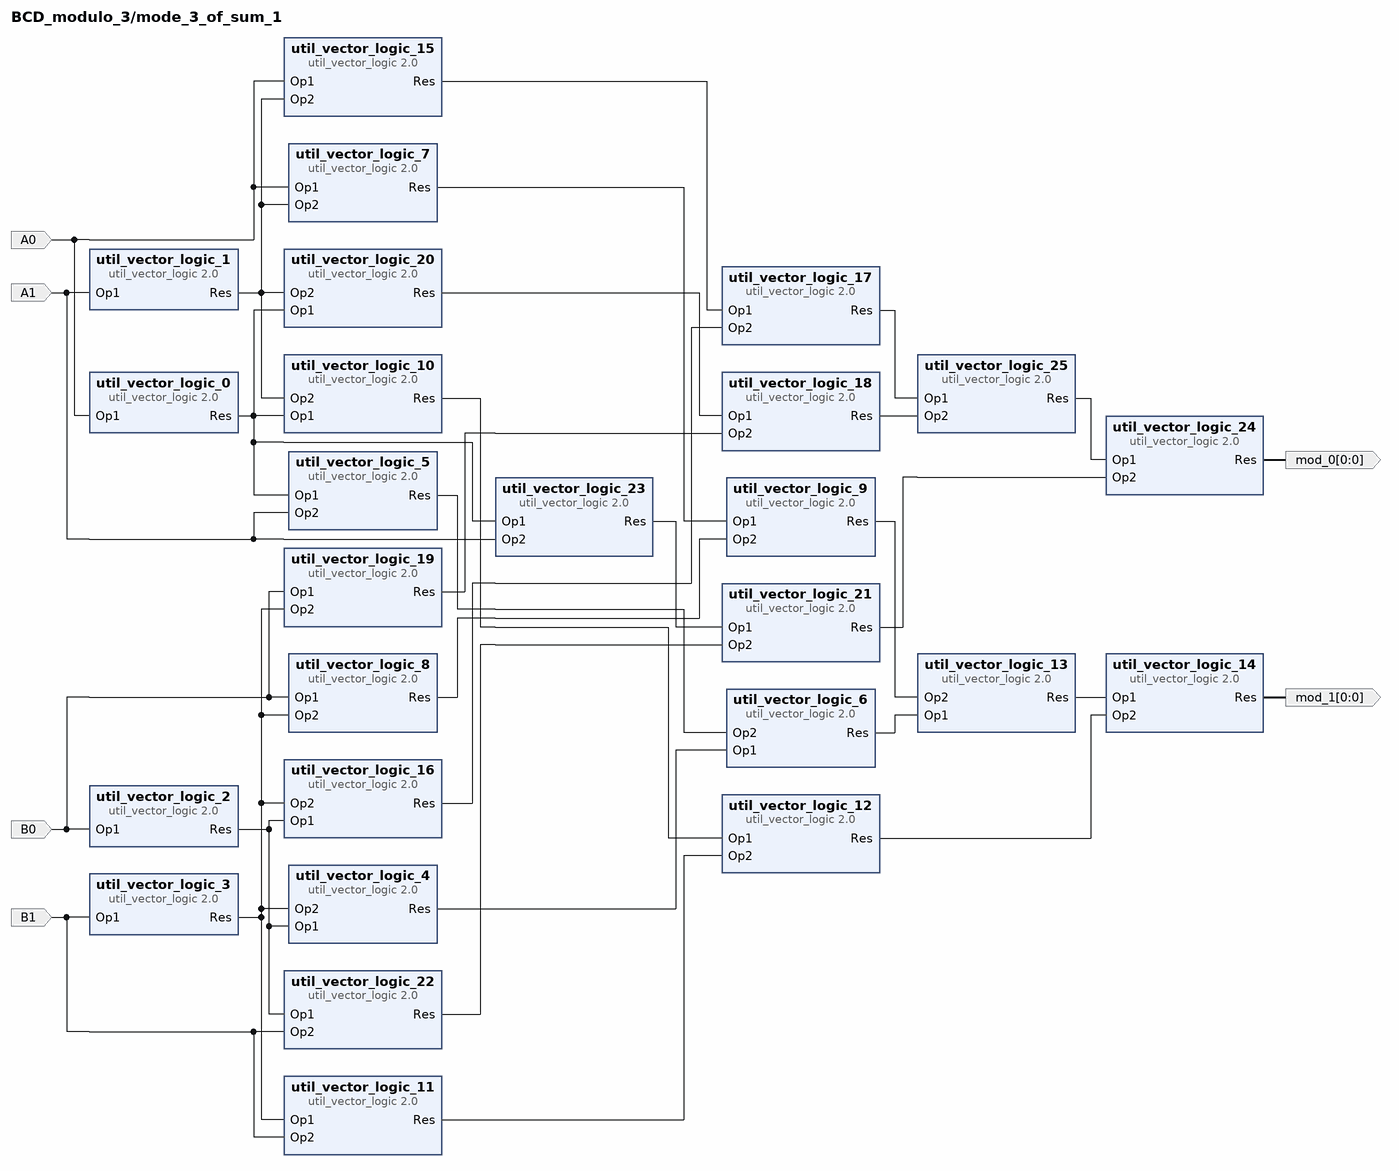
[diagram p6: block diagram inside /mode_3_of_sum_1]
create_bd_pin -dir I A0
create_bd_pin -dir I A1
create_bd_pin -dir I B0
create_bd_pin -dir I B1
create_bd_pin -dir O -from 0 -to 0 mod_1
create_bd_pin -dir O -from 0 -to 0 mod_0

create_bd_cell -type ip -vlnv xilinx.com:ip:util_vector_logic:2.0 util_vector_logic_0
set_property -dict {CONFIG.C_OPERATION not CONFIG.C_SIZE 1} [get_bd_cells util_vector_logic_0]
create_bd_cell -type ip -vlnv xilinx.com:ip:util_vector_logic:2.0 util_vector_logic_1
set_property -dict {CONFIG.C_OPERATION not CONFIG.C_SIZE 1} [get_bd_cells util_vector_logic_1]
create_bd_cell -type ip -vlnv xilinx.com:ip:util_vector_logic:2.0 util_vector_logic_2
set_property -dict {CONFIG.C_OPERATION not CONFIG.C_SIZE 1} [get_bd_cells util_vector_logic_2]
create_bd_cell -type ip -vlnv xilinx.com:ip:util_vector_logic:2.0 util_vector_logic_3
set_property -dict {CONFIG.C_OPERATION not CONFIG.C_SIZE 1} [get_bd_cells util_vector_logic_3]
create_bd_cell -type ip -vlnv xilinx.com:ip:util_vector_logic:2.0 util_vector_logic_4
set_property -dict {CONFIG.C_SIZE 1} [get_bd_cells util_vector_logic_4]
create_bd_cell -type ip -vlnv xilinx.com:ip:util_vector_logic:2.0 util_vector_logic_5
set_property -dict {CONFIG.C_SIZE 1} [get_bd_cells util_vector_logic_5]
create_bd_cell -type ip -vlnv xilinx.com:ip:util_vector_logic:2.0 util_vector_logic_6
set_property -dict {CONFIG.C_SIZE 1} [get_bd_cells util_vector_logic_6]
create_bd_cell -type ip -vlnv xilinx.com:ip:util_vector_logic:2.0 util_vector_logic_7
set_property -dict {CONFIG.C_SIZE 1} [get_bd_cells util_vector_logic_7]
create_bd_cell -type ip -vlnv xilinx.com:ip:util_vector_logic:2.0 util_vector_logic_8
set_property -dict {CONFIG.C_SIZE 1} [get_bd_cells util_vector_logic_8]
create_bd_cell -type ip -vlnv xilinx.com:ip:util_vector_logic:2.0 util_vector_logic_9
set_property -dict {CONFIG.C_SIZE 1} [get_bd_cells util_vector_logic_9]
create_bd_cell -type ip -vlnv xilinx.com:ip:util_vector_logic:2.0 util_vector_logic_10
set_property -dict {CONFIG.C_SIZE 1} [get_bd_cells util_vector_logic_10]
create_bd_cell -type ip -vlnv xilinx.com:ip:util_vector_logic:2.0 util_vector_logic_11
set_property -dict {CONFIG.C_SIZE 1} [get_bd_cells util_vector_logic_11]
create_bd_cell -type ip -vlnv xilinx.com:ip:util_vector_logic:2.0 util_vector_logic_12
set_property -dict {CONFIG.C_SIZE 1} [get_bd_cells util_vector_logic_12]
create_bd_cell -type ip -vlnv xilinx.com:ip:util_vector_logic:2.0 util_vector_logic_13
set_property -dict {CONFIG.C_OPERATION or CONFIG.C_SIZE 1} [get_bd_cells util_vector_logic_13]
create_bd_cell -type ip -vlnv xilinx.com:ip:util_vector_logic:2.0 util_vector_logic_14
set_property -dict {CONFIG.C_OPERATION or CONFIG.C_SIZE 1} [get_bd_cells util_vector_logic_14]
create_bd_cell -type ip -vlnv xilinx.com:ip:util_vector_logic:2.0 util_vector_logic_15
set_property -dict {CONFIG.C_SIZE 1} [get_bd_cells util_vector_logic_15]
create_bd_cell -type ip -vlnv xilinx.com:ip:util_vector_logic:2.0 util_vector_logic_16
set_property -dict {CONFIG.C_SIZE 1} [get_bd_cells util_vector_logic_16]
create_bd_cell -type ip -vlnv xilinx.com:ip:util_vector_logic:2.0 util_vector_logic_17
set_property -dict {CONFIG.C_SIZE 1} [get_bd_cells util_vector_logic_17]
create_bd_cell -type ip -vlnv xilinx.com:ip:util_vector_logic:2.0 util_vector_logic_18
set_property -dict {CONFIG.C_SIZE 1} [get_bd_cells util_vector_logic_18]
create_bd_cell -type ip -vlnv xilinx.com:ip:util_vector_logic:2.0 util_vector_logic_19
set_property -dict {CONFIG.C_SIZE 1} [get_bd_cells util_vector_logic_19]
create_bd_cell -type ip -vlnv xilinx.com:ip:util_vector_logic:2.0 util_vector_logic_20
set_property -dict {CONFIG.C_SIZE 1} [get_bd_cells util_vector_logic_20]
create_bd_cell -type ip -vlnv xilinx.com:ip:util_vector_logic:2.0 util_vector_logic_21
set_property -dict {CONFIG.C_SIZE 1} [get_bd_cells util_vector_logic_21]
create_bd_cell -type ip -vlnv xilinx.com:ip:util_vector_logic:2.0 util_vector_logic_22
set_property -dict {CONFIG.C_SIZE 1} [get_bd_cells util_vector_logic_22]
create_bd_cell -type ip -vlnv xilinx.com:ip:util_vector_logic:2.0 util_vector_logic_23
set_property -dict {CONFIG.C_SIZE 1} [get_bd_cells util_vector_logic_23]
create_bd_cell -type ip -vlnv xilinx.com:ip:util_vector_logic:2.0 util_vector_logic_24
set_property -dict {CONFIG.C_OPERATION or CONFIG.C_SIZE 1} [get_bd_cells util_vector_logic_24]
create_bd_cell -type ip -vlnv xilinx.com:ip:util_vector_logic:2.0 util_vector_logic_25
set_property -dict {CONFIG.C_OPERATION or CONFIG.C_SIZE 1} [get_bd_cells util_vector_logic_25]

# ---- hierarchy /mode_3_of_sum_2 ----
current_bd_instance /mode_3_of_sum_2
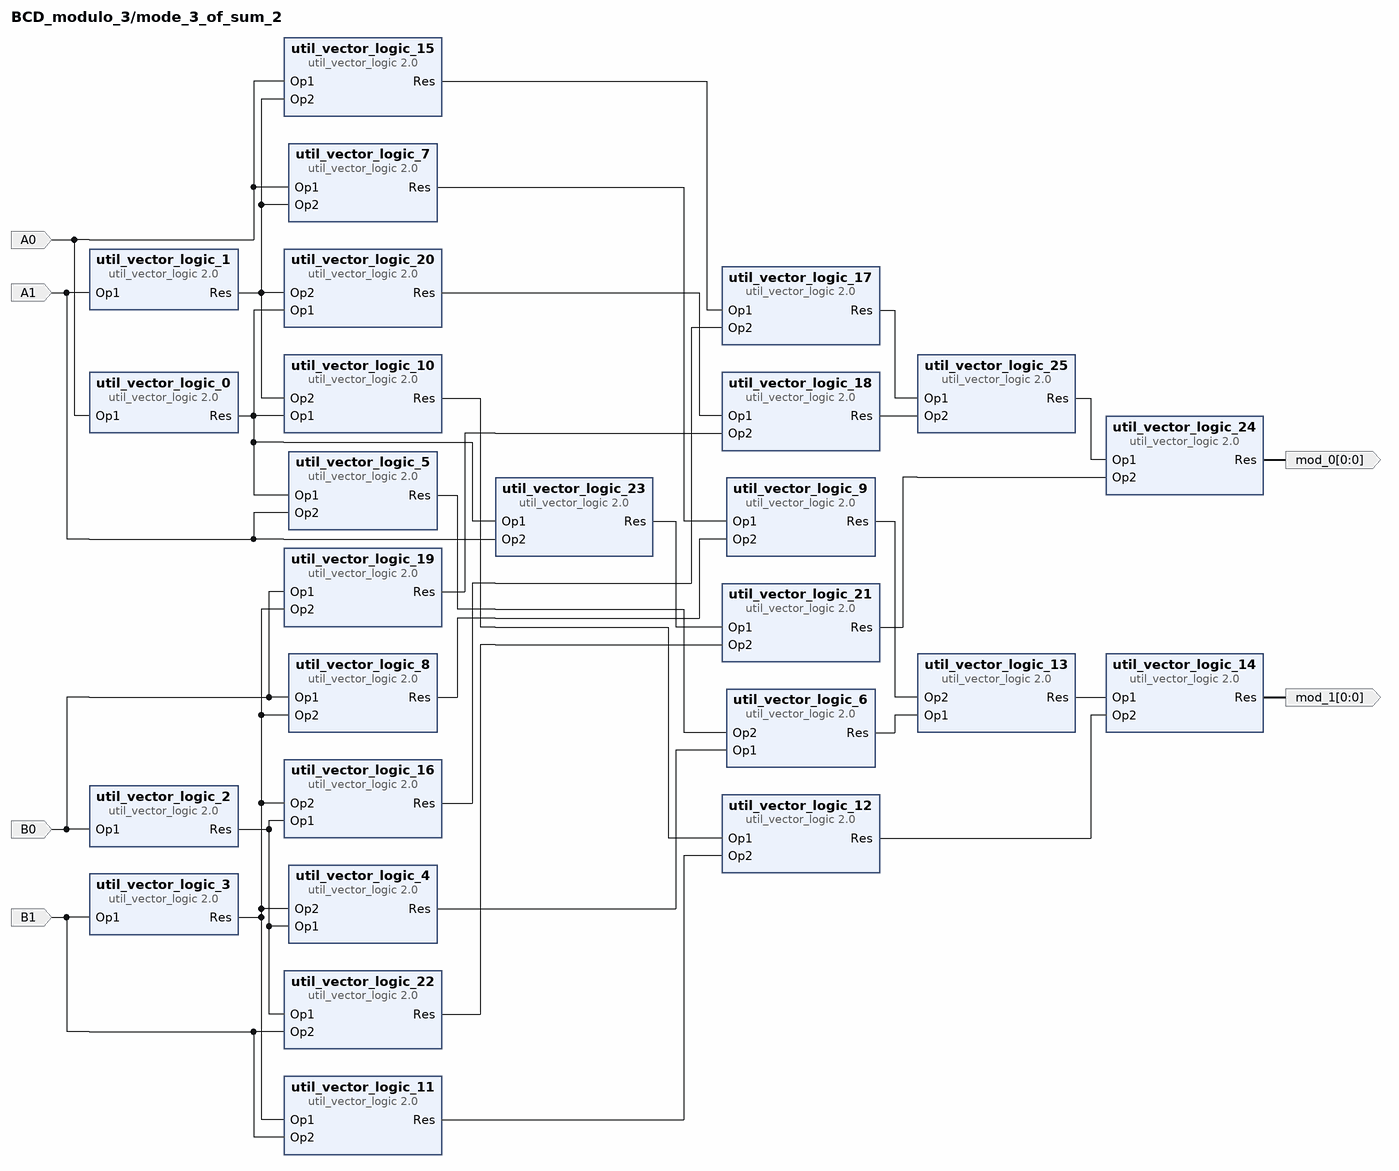
[diagram p7: block diagram inside /mode_3_of_sum_2]
create_bd_pin -dir I A0
create_bd_pin -dir I A1
create_bd_pin -dir I B0
create_bd_pin -dir I B1
create_bd_pin -dir O -from 0 -to 0 mod_1
create_bd_pin -dir O -from 0 -to 0 mod_0

create_bd_cell -type ip -vlnv xilinx.com:ip:util_vector_logic:2.0 util_vector_logic_0
set_property -dict {CONFIG.C_OPERATION not CONFIG.C_SIZE 1} [get_bd_cells util_vector_logic_0]
create_bd_cell -type ip -vlnv xilinx.com:ip:util_vector_logic:2.0 util_vector_logic_1
set_property -dict {CONFIG.C_OPERATION not CONFIG.C_SIZE 1} [get_bd_cells util_vector_logic_1]
create_bd_cell -type ip -vlnv xilinx.com:ip:util_vector_logic:2.0 util_vector_logic_2
set_property -dict {CONFIG.C_OPERATION not CONFIG.C_SIZE 1} [get_bd_cells util_vector_logic_2]
create_bd_cell -type ip -vlnv xilinx.com:ip:util_vector_logic:2.0 util_vector_logic_3
set_property -dict {CONFIG.C_OPERATION not CONFIG.C_SIZE 1} [get_bd_cells util_vector_logic_3]
create_bd_cell -type ip -vlnv xilinx.com:ip:util_vector_logic:2.0 util_vector_logic_4
set_property -dict {CONFIG.C_SIZE 1} [get_bd_cells util_vector_logic_4]
create_bd_cell -type ip -vlnv xilinx.com:ip:util_vector_logic:2.0 util_vector_logic_5
set_property -dict {CONFIG.C_SIZE 1} [get_bd_cells util_vector_logic_5]
create_bd_cell -type ip -vlnv xilinx.com:ip:util_vector_logic:2.0 util_vector_logic_6
set_property -dict {CONFIG.C_SIZE 1} [get_bd_cells util_vector_logic_6]
create_bd_cell -type ip -vlnv xilinx.com:ip:util_vector_logic:2.0 util_vector_logic_7
set_property -dict {CONFIG.C_SIZE 1} [get_bd_cells util_vector_logic_7]
create_bd_cell -type ip -vlnv xilinx.com:ip:util_vector_logic:2.0 util_vector_logic_8
set_property -dict {CONFIG.C_SIZE 1} [get_bd_cells util_vector_logic_8]
create_bd_cell -type ip -vlnv xilinx.com:ip:util_vector_logic:2.0 util_vector_logic_9
set_property -dict {CONFIG.C_SIZE 1} [get_bd_cells util_vector_logic_9]
create_bd_cell -type ip -vlnv xilinx.com:ip:util_vector_logic:2.0 util_vector_logic_10
set_property -dict {CONFIG.C_SIZE 1} [get_bd_cells util_vector_logic_10]
create_bd_cell -type ip -vlnv xilinx.com:ip:util_vector_logic:2.0 util_vector_logic_11
set_property -dict {CONFIG.C_SIZE 1} [get_bd_cells util_vector_logic_11]
create_bd_cell -type ip -vlnv xilinx.com:ip:util_vector_logic:2.0 util_vector_logic_12
set_property -dict {CONFIG.C_SIZE 1} [get_bd_cells util_vector_logic_12]
create_bd_cell -type ip -vlnv xilinx.com:ip:util_vector_logic:2.0 util_vector_logic_13
set_property -dict {CONFIG.C_OPERATION or CONFIG.C_SIZE 1} [get_bd_cells util_vector_logic_13]
create_bd_cell -type ip -vlnv xilinx.com:ip:util_vector_logic:2.0 util_vector_logic_14
set_property -dict {CONFIG.C_OPERATION or CONFIG.C_SIZE 1} [get_bd_cells util_vector_logic_14]
create_bd_cell -type ip -vlnv xilinx.com:ip:util_vector_logic:2.0 util_vector_logic_15
set_property -dict {CONFIG.C_SIZE 1} [get_bd_cells util_vector_logic_15]
create_bd_cell -type ip -vlnv xilinx.com:ip:util_vector_logic:2.0 util_vector_logic_16
set_property -dict {CONFIG.C_SIZE 1} [get_bd_cells util_vector_logic_16]
create_bd_cell -type ip -vlnv xilinx.com:ip:util_vector_logic:2.0 util_vector_logic_17
set_property -dict {CONFIG.C_SIZE 1} [get_bd_cells util_vector_logic_17]
create_bd_cell -type ip -vlnv xilinx.com:ip:util_vector_logic:2.0 util_vector_logic_18
set_property -dict {CONFIG.C_SIZE 1} [get_bd_cells util_vector_logic_18]
create_bd_cell -type ip -vlnv xilinx.com:ip:util_vector_logic:2.0 util_vector_logic_19
set_property -dict {CONFIG.C_SIZE 1} [get_bd_cells util_vector_logic_19]
create_bd_cell -type ip -vlnv xilinx.com:ip:util_vector_logic:2.0 util_vector_logic_20
set_property -dict {CONFIG.C_SIZE 1} [get_bd_cells util_vector_logic_20]
create_bd_cell -type ip -vlnv xilinx.com:ip:util_vector_logic:2.0 util_vector_logic_21
set_property -dict {CONFIG.C_SIZE 1} [get_bd_cells util_vector_logic_21]
create_bd_cell -type ip -vlnv xilinx.com:ip:util_vector_logic:2.0 util_vector_logic_22
set_property -dict {CONFIG.C_SIZE 1} [get_bd_cells util_vector_logic_22]
create_bd_cell -type ip -vlnv xilinx.com:ip:util_vector_logic:2.0 util_vector_logic_23
set_property -dict {CONFIG.C_SIZE 1} [get_bd_cells util_vector_logic_23]
create_bd_cell -type ip -vlnv xilinx.com:ip:util_vector_logic:2.0 util_vector_logic_24
set_property -dict {CONFIG.C_OPERATION or CONFIG.C_SIZE 1} [get_bd_cells util_vector_logic_24]
create_bd_cell -type ip -vlnv xilinx.com:ip:util_vector_logic:2.0 util_vector_logic_25
set_property -dict {CONFIG.C_OPERATION or CONFIG.C_SIZE 1} [get_bd_cells util_vector_logic_25]

# ---- connections ----

current_bd_instance /Mode_3_for_one_digit_0
connect_bd_net -net A0_1 [get_bd_pins A0] \
  [get_bd_pins util_vector_logic_0/Op1] [get_bd_pins util_vector_logic_4/Op1] [get_bd_pins util_vector_logic_8/Op1] \
  [get_bd_pins util_vector_logic_17/Op1]
connect_bd_net -net A1_1 [get_bd_pins A1] \
  [get_bd_pins util_vector_logic_1/Op1] [get_bd_pins util_vector_logic_8/Op2] [get_bd_pins util_vector_logic_13/Op2]
connect_bd_net -net A2_1 [get_bd_pins A2] \
  [get_bd_pins util_vector_logic_2/Op1] [get_bd_pins util_vector_logic_7/Op1] [get_bd_pins util_vector_logic_9/Op2] \
  [get_bd_pins util_vector_logic_18/Op1]
connect_bd_net -net A3_1 [get_bd_pins A3] [get_bd_pins util_vector_logic_3/Op1] [get_bd_pins util_vector_logic_20/Op2]
connect_bd_net [get_bd_pins util_vector_logic_1/Res] \
  [get_bd_pins util_vector_logic_4/Op2] [get_bd_pins util_vector_logic_7/Op2] [get_bd_pins util_vector_logic_17/Op2] \
  [get_bd_pins util_vector_logic_21/Op2]
connect_bd_net [get_bd_pins util_vector_logic_4/Res] [get_bd_pins util_vector_logic_5/Op1]
connect_bd_net [get_bd_pins util_vector_logic_2/Res] \
  [get_bd_pins util_vector_logic_5/Op2] [get_bd_pins util_vector_logic_14/Op1] [get_bd_pins util_vector_logic_20/Op1]
connect_bd_net [get_bd_pins util_vector_logic_7/Res] [get_bd_pins util_vector_logic_6/Op2]
connect_bd_net [get_bd_pins util_vector_logic_0/Res] \
  [get_bd_pins util_vector_logic_6/Op1] [get_bd_pins util_vector_logic_13/Op1] [get_bd_pins util_vector_logic_21/Op1]
connect_bd_net [get_bd_pins util_vector_logic_8/Res] [get_bd_pins util_vector_logic_9/Op1]
connect_bd_net [get_bd_pins util_vector_logic_5/Res] [get_bd_pins util_vector_logic_10/Op1]
connect_bd_net [get_bd_pins util_vector_logic_6/Res] [get_bd_pins util_vector_logic_10/Op2]
connect_bd_net [get_bd_pins util_vector_logic_10/Res] [get_bd_pins util_vector_logic_11/Op1]
connect_bd_net [get_bd_pins util_vector_logic_9/Res] [get_bd_pins util_vector_logic_11/Op2]
connect_bd_net [get_bd_pins util_vector_logic_3/Res] \
  [get_bd_pins util_vector_logic_12/Op2] [get_bd_pins util_vector_logic_14/Op2] [get_bd_pins util_vector_logic_18/Op2]
connect_bd_net [get_bd_pins util_vector_logic_11/Res] [get_bd_pins util_vector_logic_12/Op1]
connect_bd_net [get_bd_pins util_vector_logic_12/Res] [get_bd_pins MOD_0]
connect_bd_net [get_bd_pins util_vector_logic_13/Res] [get_bd_pins util_vector_logic_15/Op1]
connect_bd_net [get_bd_pins util_vector_logic_14/Res] [get_bd_pins util_vector_logic_15/Op2]
connect_bd_net [get_bd_pins util_vector_logic_17/Res] [get_bd_pins util_vector_logic_16/Op1]
connect_bd_net [get_bd_pins util_vector_logic_18/Res] [get_bd_pins util_vector_logic_16/Op2]
connect_bd_net [get_bd_pins util_vector_logic_21/Res] [get_bd_pins util_vector_logic_19/Op1]
connect_bd_net [get_bd_pins util_vector_logic_20/Res] [get_bd_pins util_vector_logic_19/Op2]
connect_bd_net [get_bd_pins util_vector_logic_15/Res] [get_bd_pins util_vector_logic_22/Op1]
connect_bd_net [get_bd_pins util_vector_logic_16/Res] [get_bd_pins util_vector_logic_22/Op2]
connect_bd_net [get_bd_pins util_vector_logic_19/Res] [get_bd_pins util_vector_logic_23/Op2]
connect_bd_net [get_bd_pins util_vector_logic_22/Res] [get_bd_pins util_vector_logic_23/Op1]
connect_bd_net [get_bd_pins util_vector_logic_23/Res] [get_bd_pins MOD_1]

current_bd_instance /mode_3_for_one_digit_1
connect_bd_net -net A0_1 [get_bd_pins A0] \
  [get_bd_pins util_vector_logic_0/Op1] [get_bd_pins util_vector_logic_4/Op1] [get_bd_pins util_vector_logic_8/Op1] \
  [get_bd_pins util_vector_logic_17/Op1]
connect_bd_net -net A1_1 [get_bd_pins A1] \
  [get_bd_pins util_vector_logic_1/Op1] [get_bd_pins util_vector_logic_8/Op2] [get_bd_pins util_vector_logic_13/Op2]
connect_bd_net -net A2_1 [get_bd_pins A2] \
  [get_bd_pins util_vector_logic_2/Op1] [get_bd_pins util_vector_logic_7/Op1] [get_bd_pins util_vector_logic_9/Op2] \
  [get_bd_pins util_vector_logic_18/Op1]
connect_bd_net -net A3_1 [get_bd_pins A3] [get_bd_pins util_vector_logic_3/Op1] [get_bd_pins util_vector_logic_20/Op2]
connect_bd_net [get_bd_pins util_vector_logic_1/Res] \
  [get_bd_pins util_vector_logic_4/Op2] [get_bd_pins util_vector_logic_7/Op2] [get_bd_pins util_vector_logic_17/Op2] \
  [get_bd_pins util_vector_logic_21/Op2]
connect_bd_net [get_bd_pins util_vector_logic_4/Res] [get_bd_pins util_vector_logic_5/Op1]
connect_bd_net [get_bd_pins util_vector_logic_2/Res] \
  [get_bd_pins util_vector_logic_5/Op2] [get_bd_pins util_vector_logic_14/Op1] [get_bd_pins util_vector_logic_20/Op1]
connect_bd_net [get_bd_pins util_vector_logic_7/Res] [get_bd_pins util_vector_logic_6/Op2]
connect_bd_net [get_bd_pins util_vector_logic_0/Res] \
  [get_bd_pins util_vector_logic_6/Op1] [get_bd_pins util_vector_logic_13/Op1] [get_bd_pins util_vector_logic_21/Op1]
connect_bd_net [get_bd_pins util_vector_logic_8/Res] [get_bd_pins util_vector_logic_9/Op1]
connect_bd_net [get_bd_pins util_vector_logic_5/Res] [get_bd_pins util_vector_logic_10/Op1]
connect_bd_net [get_bd_pins util_vector_logic_6/Res] [get_bd_pins util_vector_logic_10/Op2]
connect_bd_net [get_bd_pins util_vector_logic_10/Res] [get_bd_pins util_vector_logic_11/Op1]
connect_bd_net [get_bd_pins util_vector_logic_9/Res] [get_bd_pins util_vector_logic_11/Op2]
connect_bd_net [get_bd_pins util_vector_logic_3/Res] \
  [get_bd_pins util_vector_logic_12/Op2] [get_bd_pins util_vector_logic_14/Op2] [get_bd_pins util_vector_logic_18/Op2]
connect_bd_net [get_bd_pins util_vector_logic_11/Res] [get_bd_pins util_vector_logic_12/Op1]
connect_bd_net [get_bd_pins util_vector_logic_12/Res] [get_bd_pins MOD_0]
connect_bd_net [get_bd_pins util_vector_logic_13/Res] [get_bd_pins util_vector_logic_15/Op1]
connect_bd_net [get_bd_pins util_vector_logic_14/Res] [get_bd_pins util_vector_logic_15/Op2]
connect_bd_net [get_bd_pins util_vector_logic_17/Res] [get_bd_pins util_vector_logic_16/Op1]
connect_bd_net [get_bd_pins util_vector_logic_18/Res] [get_bd_pins util_vector_logic_16/Op2]
connect_bd_net [get_bd_pins util_vector_logic_21/Res] [get_bd_pins util_vector_logic_19/Op1]
connect_bd_net [get_bd_pins util_vector_logic_20/Res] [get_bd_pins util_vector_logic_19/Op2]
connect_bd_net [get_bd_pins util_vector_logic_15/Res] [get_bd_pins util_vector_logic_22/Op1]
connect_bd_net [get_bd_pins util_vector_logic_16/Res] [get_bd_pins util_vector_logic_22/Op2]
connect_bd_net [get_bd_pins util_vector_logic_19/Res] [get_bd_pins util_vector_logic_23/Op2]
connect_bd_net [get_bd_pins util_vector_logic_22/Res] [get_bd_pins util_vector_logic_23/Op1]
connect_bd_net [get_bd_pins util_vector_logic_23/Res] [get_bd_pins MOD_1]

current_bd_instance /mode_3_of_sum_0
connect_bd_net -net B1_1 [get_bd_pins B1] \
  [get_bd_pins util_vector_logic_3/Op1] [get_bd_pins util_vector_logic_11/Op2] [get_bd_pins util_vector_logic_22/Op2]
connect_bd_net [get_bd_pins util_vector_logic_3/Res] \
  [get_bd_pins util_vector_logic_4/Op2] [get_bd_pins util_vector_logic_8/Op2] [get_bd_pins util_vector_logic_11/Op1] \
  [get_bd_pins util_vector_logic_16/Op2] [get_bd_pins util_vector_logic_19/Op2]
connect_bd_net [get_bd_pins util_vector_logic_2/Res] \
  [get_bd_pins util_vector_logic_4/Op1] [get_bd_pins util_vector_logic_16/Op1] [get_bd_pins util_vector_logic_22/Op1]
connect_bd_net [get_bd_pins util_vector_logic_0/Res] \
  [get_bd_pins util_vector_logic_5/Op1] [get_bd_pins util_vector_logic_10/Op1] [get_bd_pins util_vector_logic_20/Op1] \
  [get_bd_pins util_vector_logic_23/Op1]
connect_bd_net [get_bd_pins util_vector_logic_4/Res] [get_bd_pins util_vector_logic_6/Op1]
connect_bd_net [get_bd_pins util_vector_logic_5/Res] [get_bd_pins util_vector_logic_6/Op2]
connect_bd_net [get_bd_pins util_vector_logic_1/Res] \
  [get_bd_pins util_vector_logic_7/Op2] [get_bd_pins util_vector_logic_10/Op2] [get_bd_pins util_vector_logic_15/Op2] \
  [get_bd_pins util_vector_logic_20/Op2]
connect_bd_net [get_bd_pins util_vector_logic_7/Res] [get_bd_pins util_vector_logic_9/Op1]
connect_bd_net [get_bd_pins util_vector_logic_8/Res] [get_bd_pins util_vector_logic_9/Op2]
connect_bd_net -net A1_1 [get_bd_pins A1] \
  [get_bd_pins util_vector_logic_1/Op1] [get_bd_pins util_vector_logic_5/Op2] [get_bd_pins util_vector_logic_23/Op2]
connect_bd_net -net B0_1 [get_bd_pins B0] \
  [get_bd_pins util_vector_logic_2/Op1] [get_bd_pins util_vector_logic_8/Op1] [get_bd_pins util_vector_logic_19/Op1]
connect_bd_net [get_bd_pins util_vector_logic_10/Res] [get_bd_pins util_vector_logic_12/Op1]
connect_bd_net [get_bd_pins util_vector_logic_11/Res] [get_bd_pins util_vector_logic_12/Op2]
connect_bd_net -net A0_1 [get_bd_pins A0] \
  [get_bd_pins util_vector_logic_7/Op1] [get_bd_pins util_vector_logic_0/Op1] [get_bd_pins util_vector_logic_15/Op1]
connect_bd_net [get_bd_pins util_vector_logic_6/Res] [get_bd_pins util_vector_logic_13/Op1]
connect_bd_net [get_bd_pins util_vector_logic_9/Res] [get_bd_pins util_vector_logic_13/Op2]
connect_bd_net [get_bd_pins util_vector_logic_12/Res] [get_bd_pins util_vector_logic_14/Op2]
connect_bd_net [get_bd_pins util_vector_logic_13/Res] [get_bd_pins util_vector_logic_14/Op1]
connect_bd_net [get_bd_pins util_vector_logic_15/Res] [get_bd_pins util_vector_logic_17/Op1]
connect_bd_net [get_bd_pins util_vector_logic_16/Res] [get_bd_pins util_vector_logic_17/Op2]
connect_bd_net [get_bd_pins util_vector_logic_20/Res] [get_bd_pins util_vector_logic_18/Op1]
connect_bd_net [get_bd_pins util_vector_logic_19/Res] [get_bd_pins util_vector_logic_18/Op2]
connect_bd_net [get_bd_pins util_vector_logic_23/Res] [get_bd_pins util_vector_logic_21/Op1]
connect_bd_net [get_bd_pins util_vector_logic_22/Res] [get_bd_pins util_vector_logic_21/Op2]
connect_bd_net [get_bd_pins util_vector_logic_17/Res] [get_bd_pins util_vector_logic_25/Op1]
connect_bd_net [get_bd_pins util_vector_logic_18/Res] [get_bd_pins util_vector_logic_25/Op2]
connect_bd_net [get_bd_pins util_vector_logic_25/Res] [get_bd_pins util_vector_logic_24/Op1]
connect_bd_net [get_bd_pins util_vector_logic_21/Res] [get_bd_pins util_vector_logic_24/Op2]
connect_bd_net [get_bd_pins util_vector_logic_14/Res] [get_bd_pins mod_1]
connect_bd_net [get_bd_pins util_vector_logic_24/Res] [get_bd_pins mod_0]
